# Altium schematic sheet water_heating_new.SchDoc
size A
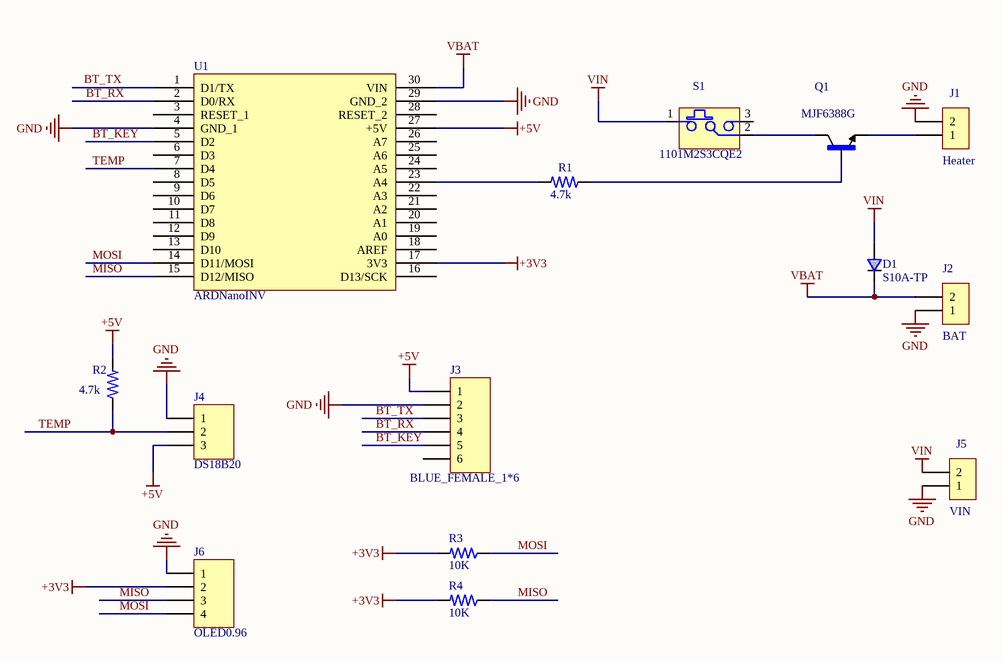
[diagram p0: water_heating_new.SchDoc]

## Parts
D1  S10A-TP  [*DIOM8059X265N]
J1  value Heater  [WJ301V-5.0-2P]  (hidden comment: WJ301V-5.0-2P)
J2  BAT  [WJ301V-5.0-2P]
J3  BLUE_FEMALE_1*6  [HDR1X6]
J4  DS18B20  [HDR1X3]
J5  value VIN  [WJ301V-5.0-2P]  (hidden comment: WJ301V-5.0-2P)
J6  OLED0.96  [HDR1X4]
Q1  MJF6388G  [TO-220]
R1  value 4.7k  [*RESC1608X55N]  (hidden comment: ERJ-3EKF1472V)
R2  value 4.7k  [*RESC1608X55N]  (hidden comment: ERJ-3EKF1472V)
R3  value 10K  [*0603]  (hidden comment: RC0603JR-0710KL)
R4  value 10K  [*0603]  (hidden comment: RC0603JR-0710KL)
S1  1101M2S3CQE2  [*SW_1101M2S3CQE2]
U1  ARDNanoINV  [ARDNanoInv]

## Nets
+3V3: J6.2 R3.2 R4.2 U1.17(3V3)
+5V: J3.1 J4.3 R2.2 U1.27(+5V)
GND: J1.2 J2.1 J3.2 J4.1 J5.1 J6.1 U1.4(GND_1) U1.29(GND_2)
VBAT: D1.1(K2) J2.2 U1.30(VIN)
VIN: D1.2(A2) J5.2 S1.1
BT_KEY: J3.5 U1.5(D2)
BT_RX: J3.4 U1.2(D0/RX)
BT_TX: J3.3 U1.1(D1/TX)
MISO: J6.3 R4.1 U1.15(D12/MISO)
MOSI: J6.4 R3.1 U1.14(D11/MOSI)
TEMP: J4.2 R2.1 U1.7(D4)
NetJ1_1: J1.1 Q1.E
NetQ1_B: Q1.B R1.1
NetQ1_C: Q1.C S1.2
NetR1_2: R1.2 U1.23(A4)

Not connected (* = marked no-connect by the designer): J3 6; S1 3; U1 3(RESET_1) 6(D3) 8(D5) 9(D6) 10(D7) 11(D8) 12(D9) 13(D10) 16(D13/SCK) 18(AREF) 19(A0) 20(A1) 21(A2) 22(A3) 24(A5) 25(A6) 26(A7) 28(RESET_2)

## Library data of the parts
D1 = S10A-TP: Diode Standard 50V 10A Surface Mount DO-214AB (HSMC); Mfr: Micro Commercial Co; Value: *; MP: S10A-TP; Digikeynumber: S10A-TPMSTR-ND
J1 J2 J5 = WJ301V-5.0-2P: P=5.0mm Screw terminal RoHS; MF: Ningbo Kangnex Elec; MP: WJ301V-5.0-2P; populate: *
  J2: Value: BAT
J3 = Header 6: Header, 6-Pin; LatestRevisionDate: 17-Jul-2002; LatestRevisionNote: Re-released for DXP Platform.; Publisher: Altium Limited
J4 = Header 3: Header, 3-Pin; LatestRevisionDate: 17-Jul-2002; LatestRevisionNote: Re-released for DXP Platform.; Publisher: Altium Limited
J6 = Header 4: Header, 4-Pin; LatestRevisionDate: 17-Jul-2002; LatestRevisionNote: Re-released for DXP Platform.; Publisher: Altium Limited
Q1 = MJF6388G: Bipolar (BJT) Transistor NPN - Darlington 100V 10A  2W Through Hole TO-220FP; MF: ON Semiconductor; MP: MJF6388G; Price: None; Value: *; Populated: *
R1 R2 = ERJ-3EKF1472V: Res Thick Film 1.6 x 0.8 mm 14.7K Ohm 1% 0.1W_1/10W_ 100ppm/ C Molded SMD Punched Carrier T/R; MF: Panasonic; MP: ERJ-3EKF1472V; Package: 1608 Panasonic Electronic Components; SnapEDA_Link: https://www.snapeda.com/parts/ERJ-3EKF1472V/Panasonic/view-part/923197/?ref=snap; Digi-Key_Purchase_URL: https://www.digikey.com.au/product-detail/en/panasonic-electronic-components/ERJ-3EKF1472V/P14.7KHCT-ND/198164?utm_source=snapeda&utm_medium=aggregator&utm_campaign=symbol; Digi-Key_Part_Number: P14.7KHCT-ND; Populated: *
R3 R4 = RC0603JR-0710KL: RES SMD 10K OHM 5% 1/10W 0603; Mf: Yageo; Digi-Key Part Number: 311-10KGRTR-ND; MP: RC0603JR-0710KL
S1 = 1101M2S3CQE2: Slide Switch SPDT Through Hole; MF: C&K; Package: None; Price: None; MP: 1101M2S3CQE2; Availability: Unavailable; SnapEDA_Link: https://www.snapeda.com/parts/1101M2S3CQE2/C%26K/view-part/287375/?ref=snap; Value: *; Populated: *